# Altium schematic sheet UI_MAIN.SchDoc
size A4; SheetNumber: 6; SheetTotal: 9
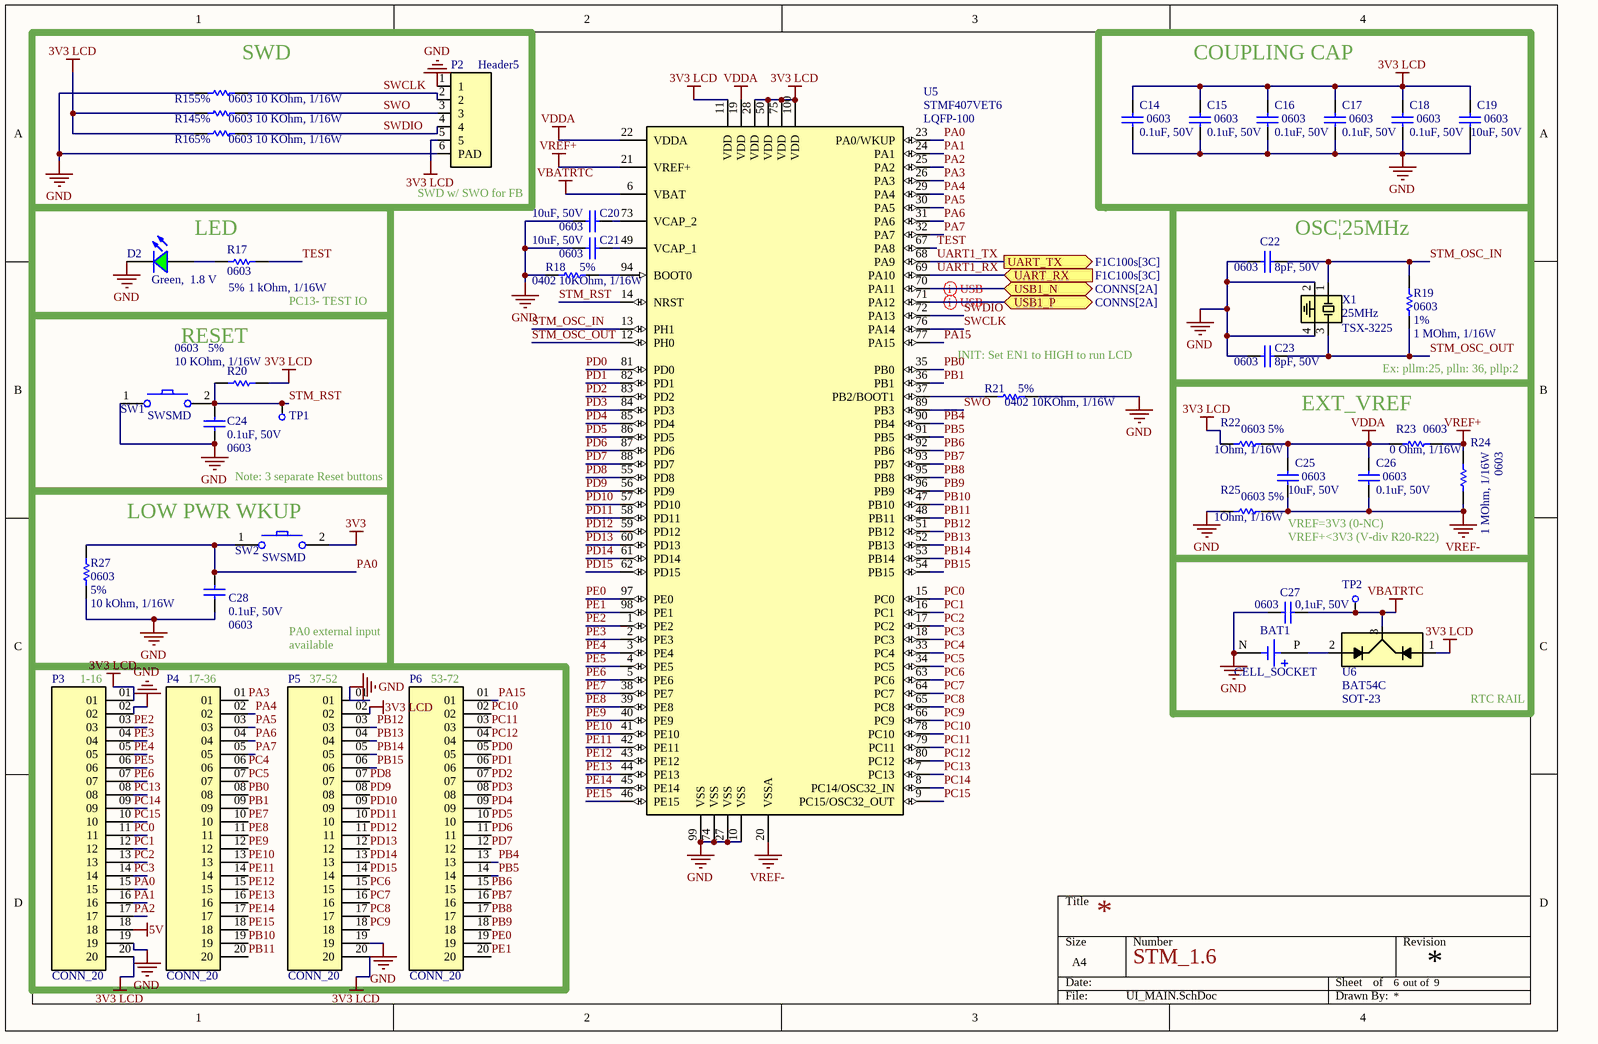
[diagram p0: UI_MAIN.SchDoc]

## Parts
BAT1  CELL_SOCKET  [CELL_SOCKET]
C14  Package: 0603  [C_0603]  (hidden comment: 0.1uF, 50V)
C15  Package: 0603  [C_0603]  (hidden comment: 0.1uF, 50V)
C16  Package: 0603  [C_0603]  (hidden comment: 0.1uF, 50V)
C17  Package: 0603  [C_0603]  (hidden comment: 0.1uF, 50V)
C18  Package: 0603  [C_0603]  (hidden comment: 0.1uF, 50V)
C19  Package: 0603  [C_0603]  (hidden comment: 10uF, 50V)
C20  Package: 0603  [C_0603]  (hidden comment: 10uF, 50V)
C21  Package: 0603  [C_0603]  (hidden comment: 10uF, 50V)
C22  Package: 0603  [C_0603]  (hidden comment: 8pF, 50V)
C23  Package: 0603  [C_0603]  (hidden comment: 8pF, 50V)
C24  Package: 0603  [C_0603]  (hidden comment: 0.1uF, 50V)
C25  Package: 0603  [C_0603]  (hidden comment: 10uF, 50V)
C26  Package: 0603  [C_0603]  (hidden comment: 0.1uF, 50V)
C27  Package: 0603  [C_0603]  (hidden comment: 0,1uF, 50V)
C28  Package: 0603  [C_0603]  (hidden comment: 0.1uF, 50V)
D2  Green,  1.8 V  [LED_0603]
P2  Header5  [CONN_Header5]
P3  CONN_20  [CONN_20]
P4  CONN_20  [CONN_20]
P5  CONN_20  [CONN_20]
P6  CONN_20  [CONN_20]
R14  Package: 0603  Acc: 5%  [R_0603]  (hidden comment: 10 KOhm, 1/16W)
R15  Package: 0603  Acc: 5%  [R_0603]  (hidden comment: 10 KOhm, 1/16W)
R16  Package: 0603  Acc: 5%  [R_0603]  (hidden comment: 10 KOhm, 1/16W)
R17  Package: 0603  Acc: 5%  [R_0603]  (hidden comment: 1 kOhm, 1/16W)
R18  Package: 0402  Acc: 5%  [R_0402]  (hidden comment: 10KOhm, 1/16W)
R19  Package: 0603  Acc: 1%  [R_0603]  (hidden comment: 1 MOhm, 1/16W)
R20  Package: 0603  Acc: 5%  [R_0603]  (hidden comment: 10 KOhm, 1/16W)
R21  Package: 0402  Acc: 5%  [R_0402]  (hidden comment: 10KOhm, 1/16W)
R22  Package: 0603  Acc: 5%  [R_0603]  (hidden comment: 1Ohm, 1/16W)
R23  Package: 0603  [R_0603]  (hidden comment: 0 Ohm, 1/16W)
R24  Package: 0603  [R_0603]  (hidden comment: 1 MOhm, 1/16W)
R25  Package: 0603  Acc: 5%  [R_0603]  (hidden comment: 1Ohm, 1/16W)
R27  Package: 0603  Acc: 5%  [R_0603]  (hidden comment: 10 kOhm, 1/16W)
SW1  SWSMD  [SW_SMD_NOGND]
SW2  SWSMD  [SW_SMD_NOGND]
TP1  TESTPT  [TESTPT]  (value not drawn)  (no BOM)
TP2  TESTPT  [TESTPT]  (value not drawn)  (no BOM)
U5  STMF407VET6  Package: LQFP-100  [PKG_LQFP-100]
U6  BAT54C  Package: SOT-23  [PKG_SOT-23]
X1  25MHz  Package: TSX-3225  [PKG_TSX-3225]

## Blocks framed on the sheet
SWD: P2 R14-R16
COUPLING CAP: C14-C19
LED: D2 R17
OSC|25MHz: C22 C23 R19 X1
RESET: C24 R20 SW1 TP1
EXT_VREF: C25 C26 R22-R25
LOW PWR WKUP: C28 R27 SW2

## Ports
UART_RX (in, see F1C100s[3C]), UART_TX (out, see F1C100s[3C]), USB1_N (bidir, see CONNS[2A]), USB1_P (bidir, see CONNS[2A])

## Nets
3V3: SW2.2
3V3 LCD: C14.2 C15.2 C16.2 C17.2 C18.2 C19.2 P2.5 P3.01 P3.20 P5.02 P5.20 R14.1 R16.1 R20.2 R22.1 U5.11(VDD) U5.28(VDD) U5.50(VDD) U5.75(VDD) U5.100(VDD) U6.1
5V: P3.18
GND: BAT1.N C14.1 C15.1 C16.1 C17.1 C18.1 C19.1 C20.2 C21.2 C22.1 C23.1 C24.1 C27.1 C28.1 D2.1(K) P2.1 P2.6(PAD) P3.02 P3.19 P5.01 P5.19 R15.1 R18.1 R21.2 R25.1 R27.1 SW1.1 U5.10(VSS) U5.27(VSS) U5.74(VSS) U5.99(VSS) X1.2 X1.4
VBATRTC: C27.2 TP2.1 U5.6(VBAT) U6.3
VDDA: C25.2 C26.2 R22.2 R23.1 U5.19(VDD) U5.22(VDDA)
VREF+: R23.2 R24.2 U5.21(VREF+)
VREF-: C25.1 C26.1 R24.1 R25.2 U5.20(VSSA)
PA0: C28.2 P3.15 R27.2 SW2.1 U5.23(PA0/WKUP)
PA1: P3.16 U5.24(PA1)
PA2: P3.17 U5.25(PA2)
PA3: P4.01 U5.26(PA3)
PA4: P4.02 U5.29(PA4)
PA5: P4.03 U5.30(PA5)
PA6: P4.04 U5.31(PA6)
PA7: P4.05 U5.32(PA7)
PA15: P6.01 U5.77(PA15)
PB0: P4.08 U5.35(PB0)
PB1: P4.09 U5.36(PB1)
PB4: P6.13 U5.90(PB4)
PB5: P6.14 U5.91(PB5)
PB6: P6.15 U5.92(PB6)
PB7: P6.16 U5.93(PB7)
PB8: P6.17 U5.95(PB8)
PB9: P6.18 U5.96(PB9)
PB10: P4.19 U5.47(PB10)
PB11: P4.20 U5.48(PB11)
PB12: P5.03 U5.51(PB12)
PB13: P5.04 U5.52(PB13)
PB14: P5.05 U5.53(PB14)
PB15: P5.06 U5.54(PB15)
PC0: P3.11 U5.15(PC0)
PC1: P3.12 U5.16(PC1)
PC2: P3.13 U5.17(PC2)
PC3: P3.14 U5.18(PC3)
PC4: P4.06 U5.33(PC4)
PC5: P4.07 U5.34(PC5)
PC6: P5.15 U5.63(PC6)
PC7: P5.16 U5.64(PC7)
PC8: P5.17 U5.65(PC8)
PC9: P5.18 U5.66(PC9)
PC10: P6.02 U5.78(PC10)
PC11: P6.03 U5.79(PC11)
PC12: P6.04 U5.80(PC12)
PC13: P3.08 U5.7(PC13)
PC14: P3.09 U5.8(PC14/OSC32_IN)
PC15: P3.10 U5.9(PC15/OSC32_OUT)
PD0: P6.05 U5.81(PD0)
PD1: P6.06 U5.82(PD1)
PD2: P6.07 U5.83(PD2)
PD3: P6.08 U5.84(PD3)
PD4: P6.09 U5.85(PD4)
PD5: P6.10 U5.86(PD5)
PD6: P6.11 U5.87(PD6)
PD7: P6.12 U5.88(PD7)
PD8: P5.07 U5.55(PD8)
PD9: P5.08 U5.56(PD9)
PD10: P5.09 U5.57(PD10)
PD11: P5.10 U5.58(PD11)
PD12: P5.11 U5.59(PD12)
PD13: P5.12 U5.60(PD13)
PD14: P5.13 U5.61(PD14)
PD15: P5.14 U5.62(PD15)
PE0: P6.19 U5.97(PE0)
PE1: P6.20 U5.98(PE1)
PE2: P3.03 U5.1(PE2)
PE3: P3.04 U5.2(PE3)
PE4: P3.05 U5.3(PE4)
PE5: P3.06 U5.4(PE5)
PE6: P3.07 U5.5(PE6)
PE7: P4.10 U5.38(PE7)
PE8: P4.11 U5.39(PE8)
PE9: P4.12 U5.40(PE9)
PE10: P4.13 U5.41(PE10)
PE11: P4.14 U5.42(PE11)
PE12: P4.15 U5.43(PE12)
PE13: P4.16 U5.44(PE13)
PE14: P4.17 U5.45(PE14)
PE15: P4.18 U5.46(PE15)
STM_OSC_IN: C22.2 R19.2 U5.13(PH1) X1.1
STM_OSC_OUT: C23.2 R19.1 U5.12(PH0) X1.3
STM_RST: C24.2 R20.1 SW1.2 TP1.1 U5.14(NRST)
SWCLK: P2.2 R15.2 U5.76(PA14)
SWDIO: P2.4 R16.2 U5.72(PA13)
SWO: P2.3 R14.2 U5.89(PB3)
TEST: R17.2 U5.67(PA8)
UART1_RX: U5.69(PA10) ; port UART_RX
UART1_TX: U5.68(PA9) ; port UART_TX
USB1_N: U5.70(PA11) ; port USB1_N
USB1_P: U5.71(PA12) ; port USB1_P
NetBAT1_P: BAT1.P U6.2
NetC20_1: C20.1 U5.73(VCAP_2)
NetC21_1: C21.1 U5.49(VCAP_1)
NetD2_2: D2.2(A) R17.1
NetR18_2: R18.2 U5.94(BOOT0)
NetR21_1: R21.1 U5.37(PB2/BOOT1)

## Layout directives
differential pair: USB1_N, USB1_P

## Notes on the sheet
- (near P2) SWD w/ SWO for FB
- (near R17) PC13- TEST IO
- INIT: Set EN1 to HIGH to run LCD
- Ex: pllm:25, plln: 36, pllp:2
- Note: 3 separate Reset buttons
- VREF=3V3 (0-NC)
- VREF+<3V3 (V-div R20-R22)
- (near P5) available
- PA0 external input
- (near P3) 1-16
- (near P4) 17-36
- (near P5) 37-52
- (near P6) 53-72
- RTC RAIL
- STM_1.6
- out of

## Library data of the parts
BAT1 = CELL_SOCKET: Battery Holder (CELL_PIN); Manufacturer 1: N/a; Manufacturer Part Number 1: N/a; Supplier 1: thegioiic; Datasheet: N/a; Supplier Link: https://www.thegioiic.com/de-pin-cr2032-3v-xuyen-lo
C14-C28 = CAP_0603: Manufacturer 1: Vishay; Manufacturer Part Number 1: CAP0603; Supplier 1: Thegioiic; Datasheet: https://www.mouser.de/datasheet/2/447/PYu_RC_Group_51_RoHS_L_11-1984063.pdf; Supplier Link: N/a
  C14-C18 C24 C26 C28: Value: 0.1uF, 50V
  C19-C21 C25: Value: 10uF, 50V
  C22 C23: Value: 8pF, 50V
  C27: Value: 0,1uF, 50V
D2 = GREEN: Green LED; Manufacturer 1: LITE-ON; Manufacturer Part Number 1: LEDG; ComponentLink1Description: Datasheet link; ComponentLink1URL: N/A; ComponentLink2Description: Supplier 1 URL; ComponentLink2URL: https://www.mouser.vn/ProductDetail/Broadcom-Avago/HSMG-C170?qs=YDL0qNrpDT4lm8ArMPkMEA%3D%3D; ComponentLink3Description: Supplier 2 URL; ComponentLink3URL: SML-LXT0805GW-TR Lumex Opto/Components Inc. | Optoelectronics | DigiKey; ComponentLink4Description: Supplier 3 URL; ComponentLink4URL: N/A; Supplier 1: ICDAYROI; Datasheet: https://www.mouser.com/datasheet/2/239/LTST-S326KGKFKT-1143909.pdf?srsltid=AfmBOorgg6Gh4PD3T9FRO6Da906Aqdqx3RSjbUQRSIXh-3hATfgAoF8Q; Supplier Link: https://icdayroi.com/led-smd-0805; Package: 1206; Value: Green,  1.8 V
P2 = HEADER5: Header 5 pins (2.54mm); Manufacturer 1: OEM; Manufacturer Part Number 1: XH2.54mm 5; Supplier 1: Thegioiic; Datasheet: N/a; Supplier Link: https://www.thegioiic.com/dau-xh2-54mm-5-chan-dan-smd-nam-ngang
P3-P6 = CONN_20: Header 20 pins (2.54mm); Manufacturer 1: OEM; Manufacturer Part Number 1: N/a; Supplier 1: N/a; Datasheet: N/a; Supplier Link: N/a
R14-R17 R19 R20 R22-R25 R27 = RES_0603: Manufacturer 1: Vishay; Manufacturer Part Number 1: RES0603; Supplier 1: Thegioiic; Datasheet: https://www.mouser.de/datasheet/2/447/PYu_RC_Group_51_RoHS_L_11-1984063.pdf; Supplier Link: N/a
  R14-R16 R20: Value: 10 KOhm, 1/16W
  R17: Value: 1 kOhm, 1/16W
  R19 R24: Value: 1 MOhm, 1/16W
  R22 R25: Value: 1Ohm, 1/16W
  R23: Value: 0 Ohm, 1/16W
  R27: Value: 10 kOhm, 1/16W
R18 R21 = RES_0402: Manufacturer 1: Vishay; Manufacturer Part Number 1: RES0402; Supplier 1: Thegioiic; Datasheet: https://www.mouser.de/datasheet/2/447/PYu_RC_Group_51_RoHS_L_11-1984063.pdf; Supplier Link: N/a; Value: 10KOhm, 1/16W
SW1 SW2 = SWSMD_NOGND: SW_SMD; Manufacturer 1: OEM; Manufacturer Part Number 1: N/a; Supplier 1: Thegioiic; Datasheet: N/a; Supplier Link: https://www.thegioiic.com/nut-nhan-3x6mm-cao-3-5mm-4-chan-smd-chinh-ngang
TP1 TP2 = TESTPT: Test point
U5 = STMF407VET6: Arm® Cortex®-M4 32b MCU+FPU, 210DMIPS, up to 1MB flash/192+4KB RAM, USB / OTG HS/FS, Ethernet, 17 TIMs, 3 ADCs, 15 comm. interfaces, and camera; Manufacturer 1: STMicroelectronics; Manufacturer Part Number 1: STMF407VET6; Supplier 1: Thegioiic; Datasheet: https://www.st.com/content/ccc/resource/technical/document/datasheet/ef/92/76/6d/bb/c2/4f/f7/DM00037051.pdf/files/DM00037051.pdf/jcr:content/translations/en.DM00037051.pdf; Supplier Link: https://www.thegioiic.com/stm32f407vet6-32-bit-arm-cortex-m4-microcontroller-168mhz-512kb-flash-100-lqfp
U6 = BAT54C: P-Channel 30 V 4A (Ta) 1.4W (Ta) Surface Mount SOT-23-3; Manufacturer 1: ON Semiconductor; Manufacturer Part Number 1: BAT54C; Supplier 1: thegioiic; Datasheet: https://media.digikey.com/pdf/Data%20Sheets/ON%20Semiconductor%20PDFs/BAT54(A,C,S).pdf; Supplier Link: https://www.thegioiic.com/bat54c
X1 = XTAL: Crystal, 25 MHz, -30 to 85 degC, 3.2 x 2.5 x 0.9 mm SMD; Manufacturer 1: EPSON; Manufacturer Part Number 1: TSX-3225 25.0000MF20P-C0; Supplier 1: Thegioiic; Datasheet: https://www.epsondevice.com/crystal/en/; Supplier Link: https://www.thegioiic.com/thach-anh-25mhz-3225-4-chan-smd